# Altium schematic sheet 05 - POWER.SchDoc
size A; SheetNumber: 4; SheetTotal: 4
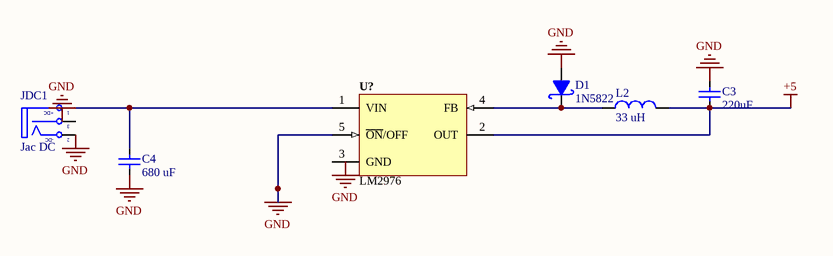
[diagram p0: 05 - POWER.SchDoc]

## Parts
C3  220uF  [CAP_0402]
C4  680 uF  [CAP_0402]
D1  1N5822  [SMA]
JDC1  Jac DC  [DC-IN]
L2  33 uH  [L/0.4]
U?  LM2976  [TO-263]

## Nets
+5: C3.1 L2.2 U?.2(OUT)
GND: C3.2 C4.1 D1.1(A) JDC1.2(TN) U?.5(~{ON}/OFF)
NetC4_2: C4.2 JDC1.1(T) U?.1(VIN)
NetD1_2: D1.2(K) L2.1 U?.4(FB)

Not connected (* = marked no-connect by the designer): JDC1 3(S); U? 3(GND)

## Notes on the sheet
- Labels drawn without touching a wire or pin: GND
- (in symbol DCIN) +DC; -DC

## Library data of the parts
C3 C4 = CapSMD: Capacitor; Value: 33p; Published: 8-Jun-2000; LatestRevisionDate: 17-Jul-2002; LatestRevisionNote: Re-released for DXP Platform.; PackageReference: RAD-0.3; Publisher: Altium Limited
D1 = 1N5822: Schottky Rectifiers; Value: Diode c?m 1N5408
JDC1 = DCIN: Jac DC input; Value: Jac DC
L2 = L1: Inductor; Value: 150 mH
U? = LM2596: Max Input Voltage: 12 V; Max Output Current: 3 (6.0 peak) A; Max Output Voltage: mV; Category: IC-Power; Min Input Voltage: mV; Min Output Voltage: mV; Mounting Technology: Surface Mount; Status: Unreleased; Supply Voltage: mV; Temperature Range: -40 to +125 degC